# Altium schematic sheet TPS6209733_Buck_2A_3V3_FixedOutput.SchDoc: +3V3 Output DC-DC Converter
size A4
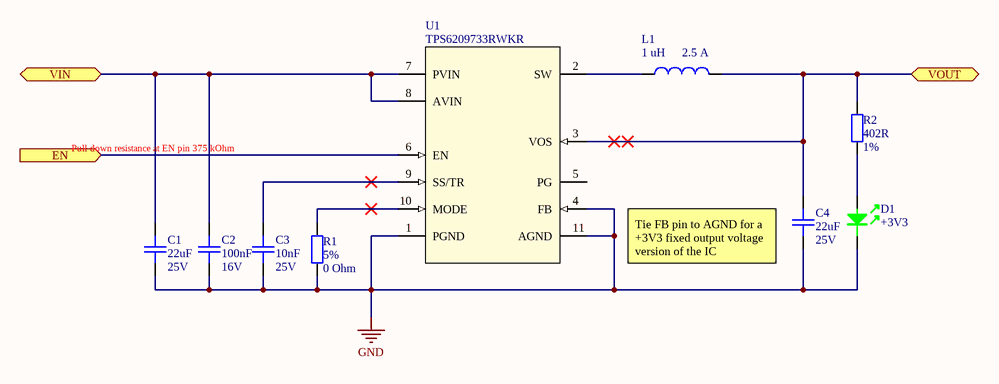
[diagram p0: TPS6209733_Buck_2A_3V3_FixedOutput.SchDoc]

## Parts
C1  Capacitance: 22uF  Voltage Rating: 25V  [C0805]  (hidden comment: CAP CER 22UF 25V X5R 0805)
C2  Capacitance: 100nF  Voltage: 16V  [C0402]  (hidden comment: CAP CER 0.1UF 16V X7R 0402)
C3  Capacitance: 10nF  Voltage: 25V  [C0402]  (hidden comment: CAP CER 10nF 25V X7R 10% 0402)
C4  Capacitance: 22uF  Voltage Rating: 25V  [C0805]  (hidden comment: CAP CER 22UF 25V X5R 0805)
D1  +3V3  [LED_0603]
L1  Inductance: 1 uH  Maximum DC Current: 2.5 A  [74438323010]  (hidden comment: FIXED IND 1UH 2.5A 75 MOHM SMD)
R1  Tolerance: 5%  Resistance: 0 Ohm  [R0402]  (hidden comment: RES SMD 0 OHM JUMPER 1/16W 0402)
R2  Resistance: 402R  Tolerance: 1%  [R0402]  (hidden comment: RES SMD 402 OHM 1% 1/16W 0402)
U1  TPS6209733RWKR  [RWK11]

## Ports
EN (in), VIN, VOUT

## Nets
GND: C1.2 C2.1 C3.1 C4.2 D1.1(K) R1.1 U1.1(PGND) U1.4(FB) U1.11(AGND)
EN: U1.6(EN) ; port EN
VIN: C1.1 C2.2 U1.7(PVIN) U1.8(AVIN) ; port VIN
VOUT: C4.1 L1.2 R2.2 U1.3(VOS) ; port VOUT
NetC3_2: C3.2 U1.9(SS/TR)
NetD1_2: D1.2(A) R2.1
NetL1_1: L1.1 U1.2(SW)
NetR1_2: R1.2 U1.10(MODE)

Not connected (* = marked no-connect by the designer): U1 5(PG)

## Notes on the sheet
- (near U1) Pull-down resistance at EN pin 375 kOhm
- (near C4) Tie FB pin to AGND for a +3V3 fixed output voltage version of the IC
- Title
- Size:
- Date:
- A4
- Number:
- Time:
- Revision:
- Sheet
- of
- File:

## Library data of the parts
C1 C4 = CAP CER 22UF 25V X5R 0805: 22µF ±20% 25V Ceramic Capacitor X5R 0805 (2012 Metric); Manufacturer: Yageo; Manufacturer Part Number: CC0805MKX5R8BB226; Supplier 1: Digi-Key; Stock 1: 1060; Pricing 1: 1=0.5, 10=0.353, 50=0.267, 100=0.2325, 500=0.1722, 1000=0.1464 (USD); Mount: Surface Mount; Case/Package: 0805; Case Code (Metric): 2012; Case Code (Imperial): 0805; Min Operating Temperature: -55°C; Max Operating Temperature: 85°C; Packaging: Tape and Reel; Tolerance: 20%; Voltage Rating (DC): 25V; Dielectric: X5R; Termination: SMD/SMT; Package Quantity: 3000; Length: 0.079inch; Height: 1.25mm; Width: 0.049inch; Thickness: 0.057inch; ComponentLink1URL: http://www.yageo.com/documents/recent/UPY-GPHC_X5R_4V-to-50V_25.pdf?src-supplier=Digi-Key; ComponentLink1Description: http://www.yageo.com/documents/recent/UPY-GPHC_X5R_4V-to-50V_25.pdf?src-supplier=Digi-Key; ComponentLink2URL: http://www.mouser.com/ds/2/447/Yageo_UPY-GP_NP0_16V-to-50V_9-358835.pdf?src-supplier=Mouser; ComponentLink2Description: http://www.mouser.com/ds/2/447/Yageo_UPY-GP_NP0_16V-to-50V_9-358835.pdf?src-supplier=Mouser; Supplier Part Number 1: 311-1903-1-ND; Weight: 0.000194oz; Lead Free: Lead Free; Halogen Free: Halogen Free
C2 = CAP CER 0.1UF 16V X7R 0402: 0.1µF ±10% 16V Ceramic Capacitor X7R 0402 (1005 Metric); Manufacturer Part Number: CC0402KRX7R7BB104; Manufacturer: Yageo; Revision: July-2002: Re-released for DXP Platform.; Order: CC0402KRX7R7BB104; Supplier 1: Digi-Key; Stock 1: 25916830; Pricing 1: 1=0.1, 10=0.031, 100=0.0136, 500=0.0097, 1000=0.0077, 2500=0.007, 5000=0.0064 (USD); Mount: Surface Mount; Number of Pins: 2; Case Code (Metric): 1005; Case Code (Imperial): 0402; Min Operating Temperature: -55°C; Max Operating Temperature: 125°C; Tolerance: 10%; Dielectric: X7R; Voltage Rating: 16V; Voltage Rating (DC): 16V; Packaging: Tape and Reel; Package Quantity: 1; Termination: SMD/SMT; Composition: Ceramic; Length: 1mm; Height: 0.5mm; Width: 0.02inch; Thickness: 0.022inch; Depth: 0.5mm; Radiation Hardening: No; REACH SVHC: No SVHC; Lead Free: Lead Free; Halogen Free: Halogen Free; ComponentLink1URL: http://www.yageo.com/documents/recent/UPY-GPHC_X7R_6.3V-to-50V_8.pdf?src-supplier=Avnet+Europe; ComponentLink1Description: http://www.yageo.com/documents/recent/UPY-GPHC_X7R_6.3V-to-50V_8.pdf?src-supplier=Avnet+Europe; ComponentLink2URL: http://www.yageo.com/documents/recent/UPY-GPHC_X7R_6.3V-to-50V_18.pdf?src-supplier=Digi-Key; ComponentLink2Description: http://www.yageo.com/documents/recent/UPY-GPHC_X7R_6.3V-to-50V_18.pdf?src-supplier=Digi-Key; ComponentLink3URL: http://www.yageo.com/documents/recent/UPY-GPHC_X7R_6.3V-to-50V_8.pdf?src-supplier=Avnet; ComponentLink3Description: http://www.yageo.com/documents/recent/UPY-GPHC_X7R_6.3V-to-50V_8.pdf?src-supplier=Avnet; ComponentLink4URL: http://www.yageo.com/documents/recent/UPY-GPHC_X7R_6.3V-to-50V_18.pdf?src-supplier=Mouser; ComponentLink4Description: http://www.yageo.com/documents/recent/UPY-GPHC_X7R_6.3V-to-50V_18.pdf?src-supplier=Mouser; ComponentLink5URL: http://www.farnell.com/datasheets/2167236.pdf?src-supplier=Element14; ComponentLink5Description: http://www.farnell.com/datasheets/2167236.pdf?src-supplier=Element14; ComponentLink6URL: http://www.farnell.com/datasheets/1489800.pdf?src-supplier=Element14; ComponentLink6Description: http://www.farnell.com/datasheets/1489800.pdf?src-supplier=Element14; Supplier Part Number 1: 311-1338-1-ND
C3 = CAP CER 10nF 25V X7R 10% 0402: Manufacturer: Kyocera AVX; Manufacturer Part Number: 04023C103KAT2A; Dissipation Factor: 12.5%; Insulation Resistance: 100GR; Supplier 1: Digi-Key; Stock 1: 1015537; Pricing 1: 1=0.1, 10=0.034, 50=0.0182, 100=0.0149, 500=0.0107, 1000=0.0084, 2500=0.0076, 5000=0.007 (USD); Mount: Surface Mount; Case Code (Metric): 1005; Case Code (Imperial): 0402; Min Operating Temperature: -55°C; Max Operating Temperature: 125°C; Tolerance: 10%; Dielectric: X7R; Voltage Rating (DC): 25V; Packaging: Tape and Reel; Voltage Rating: 25V; Package Quantity: 1; Termination: SMD/SMT; Length: 1mm; Height: 0.56mm; Depth: 0.5mm; Width: 0.02inch; Thickness: 0.022inch; Radiation Hardening: No; REACH SVHC: No SVHC; Lead Free: Lead Free; ComponentLink1URL: http://www.farnell.com/datasheets/2237835.pdf?src-supplier=Element14; ComponentLink1Description: http://www.farnell.com/datasheets/2237835.pdf?src-supplier=Element14; ComponentLink2URL: http://catalogs.avx.com/SurfaceMount.pdf?src-supplier=Digi-Key; ComponentLink2Description: http://catalogs.avx.com/SurfaceMount.pdf?src-supplier=Digi-Key; ComponentLink3URL: http://www.alliedelec.com/m/d/a24bb5190bea413b2ff164816f55e87c.pdf?src-supplier=Allied+Electronics; ComponentLink3Description: http://www.alliedelec.com/m/d/a24bb5190bea413b2ff164816f55e87c.pdf?src-supplier=Allied+Electronics; ComponentLink4URL: http://uk.rs-online.com/webdocs/13ec/0900766b813ece35.pdf?src-supplier=RSComponents; ComponentLink4Description: http://uk.rs-online.com/webdocs/13ec/0900766b813ece35.pdf?src-supplier=RSComponents; Supplier Part Number 1: 478-1113-1-ND; Case/Package: 0402
D1 = LED GREEN CLEAR 0603 SMD: Green 571nm LED Indication - Discrete 2V 0603 (1608 Metric); Manufacturer: Vishay Lite-On; Manufacturer Part Number: LTST-C191KGKT; Lens Color: Colorless; Luminous Intensity: 35mcd; Viewing Angle: 130°; Test Current: 20mA; Lens Transparency: Clear; Wavelength: 574nm; Lens Style: Rectangular,Colorless; Forward Current: 30mA; Number of Elements: 1; Power Dissipation: 75mW; Reverse Voltage: 5V; Supplier 1: Digi-Key; Supplier Part Number 1: 160-1446-6-ND; Stock 1: 788359; Pricing 1: 1=0.28, 10=0.201, 100=0.0954, 500=0.0636, 1000=0.0498, 2500=0.0488 (USD); Mount: Surface Mount; Number of Pins: 2; Case Code (Metric): 1608; Case Code (Imperial): 0603; Min Operating Temperature: -55°C; Max Operating Temperature: 85°C; Packaging: Tape and Reel; Package Quantity: 1; Forward Voltage: 2V; Dominant Wavelength: 571nm; Illumination Color: Green; Number of LEDs: 1; Power Rating: 75mW; Max Power Dissipation: 75mW; Length: 1.6mm; Height: 0.55mm; Width: 0.8mm; Depth: 0.8mm; Radiation Hardening: No; Lead Free: Lead Free; ComponentLink1URL: http://optoelectronics.liteon.com/upload/download/DS22-2000-228/LTST-C191KGKT.PDF?src-supplier=Digi-Key; ComponentLink1Description: http://optoelectronics.liteon.com/upload/download/DS22-2000-228/LTST-C191KGKT.PDF?src-supplier=Digi-Key
L1 = FIXED IND 1UH 2.5A 75 MOHM SMD: 1µH Shielded Molded Inductor 2.5A 75mOhm Max 1008 (2520 Metric); Manufacturer: Wurth Elektronik; Tolerance: 20 %; Self Resonant Frequency: 80 MHz; Test Frequency: 100 kHz; Type: SMD Inductor; ComponentLink1URL: https://www.mouser.com/datasheet/2/445/74438323010-1721873.pdf; ComponentLink1Description: https://www.mouser.com/datasheet/2/445/74438323010-1721873.pdf; Supplier 1: Mouser; Manufacturer Part Number: 74438323010; Stock 1: 4771; Pricing 1: 1=1.13, 10=1.10, 50=1.03, 100=0.961, 500=0.887, 1000=0.813, 3000=0.739 (USD); Packaging: Cut Tape; Shielding: Shielded; Termination: -; Length: 2.5 mm; Height: 1 mm; Width: 2 mm; Supplier Part Number 1: 710-74438323010; RoHS: RoHS Compliant; Category: Fixed Inductors; Application: Power; Maximum DC Resistance: 75 mOhms; Package / Case: 1008 (2520 metric); Product: Power Inductors; Series: WE-MAPI; Termination Style: SMD/SMT; Brand: Wurth Elektronik; Mounting Style: PCB Mount; Case Code - in: 1008; Case Code - mm: 2520; Maximum Operating Temperature: + 125 C; Minimum Operating Temperature: - 40 C; Product Type: Fixed Inductors; Standard Pack Qty: 3000; Subcategory: Inductors, Chokes & Coils; RoHS - Mouser: Y; Minimum Order Quantity: 1; Reeling: True; Mount: Surface Mount
R1 = RES SMD 0 OHM JUMPER 1/16W 0402: 0 Ohms Jumper 0.063W, 1/16W Chip Resistor 0402 (1005 Metric) Moisture Resistant Thick Film; Manufacturer: Yageo; Manufacturer Part Number: RC0402JR-070RL; Power Rating: 62.5mW; Voltage Rating: 50V; Max Power Dissipation: 63mW; Temperature Coefficient: 200ppm/°C; Supplier 1: Digi-Key; Case Code (Metric): 1005; Case Code (Imperial): 0402; Composition: Thick Film; Length: 1mm; Height: 0.016inch; Width: 0.02inch; Depth: 0.5mm; Lead Free: Lead Free; Supplier Part Number 1: 311-0.0JRCT-ND; Case/Package: 0402; Stock 1: 46057148; Pricing 1: 1=0.1, 10=0.013, 25=0.0092, 50=0.0072, 100=0.0053, 250=0.004, 500=0.0032, 1000=0.0024, 5000=0.0017 (USD); Contact Plating: Tin,Matte; Min Operating Temperature: -55°C; Max Operating Temperature: 155°C; Packaging: Tape and Reel; Package Quantity: 1; Number of Terminations: 2; Termination: SMD/SMT; Military Standard: Not; Features: Moisture Resistant; Radiation Hardening: No; REACH SVHC: Unknown; ComponentLink1URL: http://www.yageo.com/documents/recent/PYu-RC_Group_51_RoHS_L_10.pdf?src-supplier=Digi-Key; ComponentLink1Description: http://www.yageo.com/documents/recent/PYu-RC_Group_51_RoHS_L_10.pdf?src-supplier=Digi-Key; ComponentLink2URL: http://www.yageo.com/documents/recent/PYu-RC0402_51_RoHS_L_6.pdf?src-supplier=Avnet+Europe; ComponentLink2Description: http://www.yageo.com/documents/recent/PYu-RC0402_51_RoHS_L_6.pdf?src-supplier=Avnet+Europe; ComponentLink3URL: http://www.farnell.com/datasheets/1018594.pdf?src-supplier=Element14; ComponentLink3Description: http://www.farnell.com/datasheets/1018594.pdf?src-supplier=Element14; ComponentLink4URL: https://www.verical.com/server-webapp/html/getDatasheet?partID=326379&src-supplier=Verical; ComponentLink4Description: https://www.verical.com/server-webapp/html/getDatasheet?partID=326379&src-supplier=Verical; ComponentLink5URL: http://www.farnell.com/datasheets/2167052.pdf?src-supplier=Element14; ComponentLink5Description: http://www.farnell.com/datasheets/2167052.pdf?src-supplier=Element14; Mount: Surface Mount
R2 = RES SMD 402 OHM 1% 1/16W 0402: 402 Ohms ±1% 0.063W, 1/16W Chip Resistor 0402 (1005 Metric) Moisture Resistant Thick Film; Manufacturer: Yageo; Manufacturer Part Number: RC0402FR-07402RL; Power Rating: 62.5mW; Voltage Rating: 50V; Temperature Coefficient: 100ppm/°C; Max Power Dissipation: 63mW; Supplier 1: Digi-Key; Stock 1: 0; Pricing 1: 1=0.1, 10=0.016, 100=0.0064, 1000=0.0029, 2500=0.0025, 5000=0.0021 (USD); Case/Package: 0402; Case Code (Imperial): 0402; Case Code (Metric): 1005; Min Operating Temperature: -55°C; Max Operating Temperature: 155°C; Packaging: Tape and Reel; Termination: SMD/SMT; Composition: Thick Film; Military Standard: Not; Length: 0.039inch; Depth: 0.5mm; Lead Free: Lead Free; Supplier Part Number 1: YAG3152CT-ND; Contact Plating: Tin,Matte; Number of Terminations: 2; Features: Moisture Resistant; Height: 0.016inch; Width: 0.02inch; ComponentLink1URL: http://www.yageo.com/documents/recent/PYu-RC0402_51_RoHS_L_6.pdf?src-supplier=Avnet; ComponentLink1Description: http://www.yageo.com/documents/recent/PYu-RC0402_51_RoHS_L_6.pdf?src-supplier=Avnet; ComponentLink2URL: http://www.yageo.com/documents/recent/PYu-RC0402_51_RoHS_L_6.pdf?src-supplier=Avnet+Europe; ComponentLink2Description: http://www.yageo.com/documents/recent/PYu-RC0402_51_RoHS_L_6.pdf?src-supplier=Avnet+Europe; ComponentLink3URL: http://www.mouser.com/ds/2/447/PYu-RC0402_51_RoHS_L_6_r-8721.pdf?src-supplier=Mouser; ComponentLink3Description: http://www.mouser.com/ds/2/447/PYu-RC0402_51_RoHS_L_6_r-8721.pdf?src-supplier=Mouser; Mount: Surface Mount
U1 = IC TPS6209733 REG BUCK FIXED 3.3V 2A 11VQFN: Buck Switching Regulator IC Positive Fixed 3.3V 1 Output 2A 11-VFQFN; Manufacturer: Texas Instruments; Number of Outputs: 1; Max Input Voltage: 6V; Min Input Voltage: 2.5V; Switching Frequency: 2.5MHz; Synchronous Rectifier: Yes; Quiescent Current: 40uA; ComponentLink1URL: http://www.ti.com/lit/gpn/tps62097?src-supplier=Mouser; ComponentLink1Description: http://www.ti.com/lit/gpn/tps62097?src-supplier=Mouser; Supplier 1: Digi-Key; Manufacturer Part Number: TPS6209733RWKR; Stock 1: 1536; Pricing 1: 1=1.74, 10=1.561, 100=1.1783, 500=1.0016, 1000=0.7954 (USD); Number of Pins: 11; Min Operating Temperature: -40°C; Max Operating Temperature: 125°C; Packaging: Tape and Reel; Output Current: 2A; Min Output Voltage: 3.3V; Output Type: Fixed; Output Configuration: Positive; Lead Free: Lead Free; Supplier Part Number 1: 296-49007-1-ND; Mount: Surface Mount; Case/Package: VQFN; ComponentLink2URL: http://www.ti.com/lit/ds/symlink/tps62097.pdf?src-supplier=Digi-Key; ComponentLink2Description: http://www.ti.com/lit/ds/symlink/tps62097.pdf?src-supplier=Digi-Key